# Altium schematic sheet NEB_ISE_INT.SchDoc
size A4; CompanyName: Altium; DrawnBy: Ch.W.; Organization: Altium Limited; Address1: L3, 12a Rodborough Rd; Address2: Frenchs Forest; Address3: NSW; Address4: Australia 2086; DocumentNumber: 5; Revision: V0.9; SheetNumber: 5; SheetTotal: 10
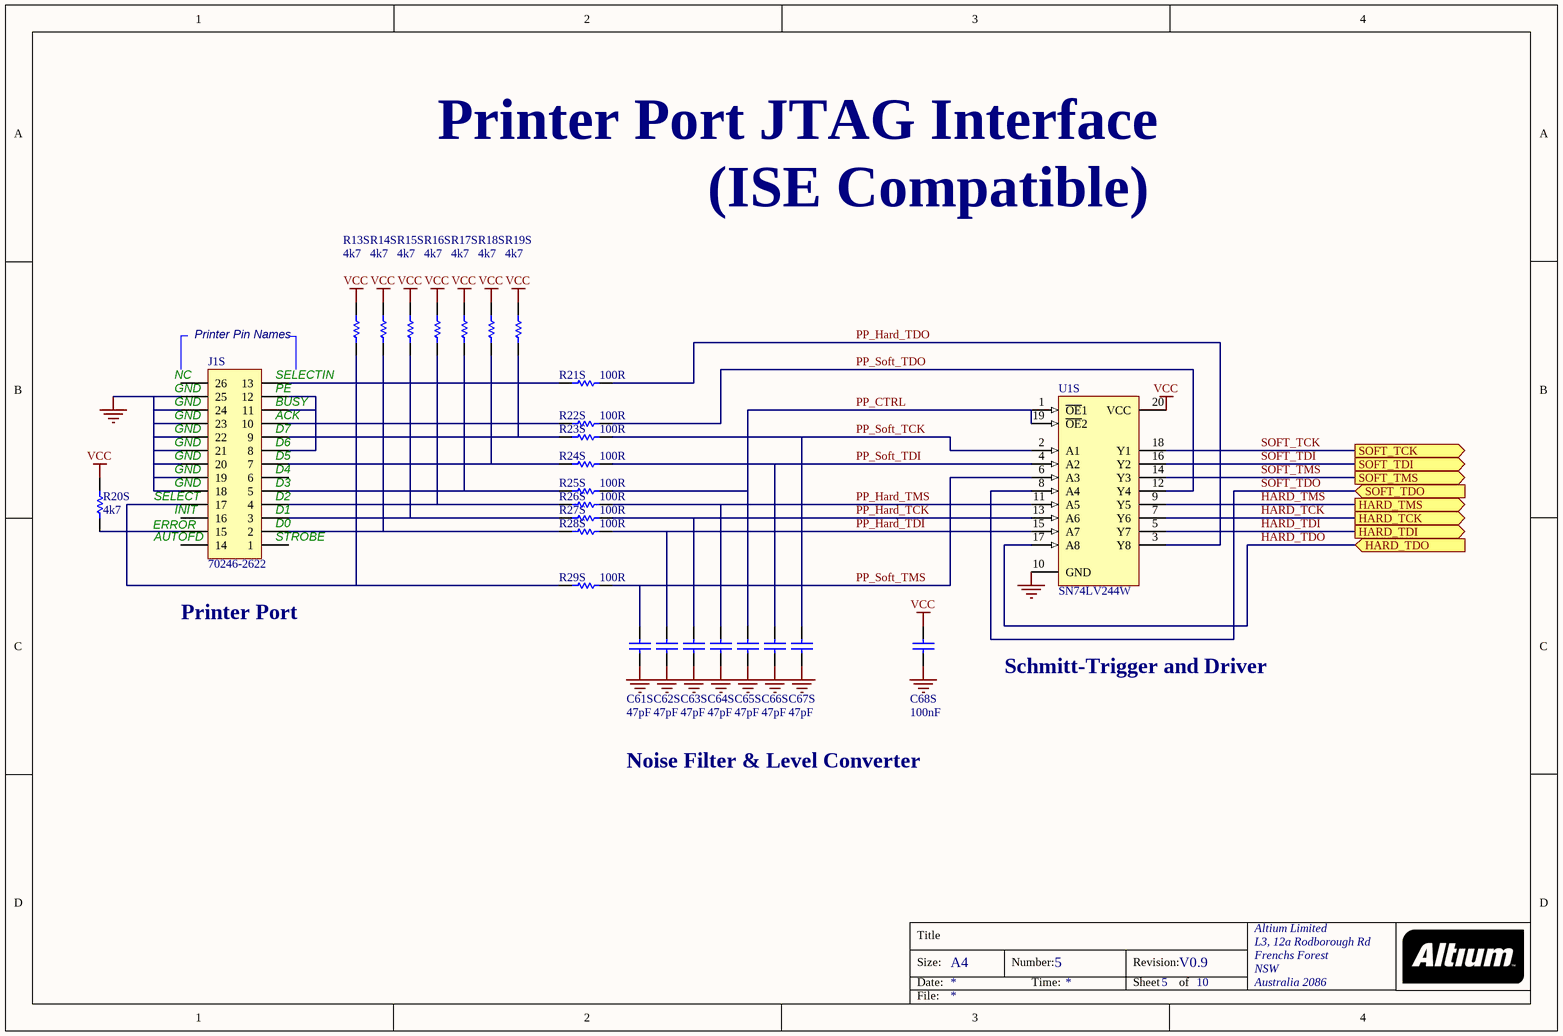
[diagram p0: NEB_ISE_INT.SchDoc]

## Parts
C61S  47pF  [CC2012-0805]
C62S  47pF  [CC2012-0805]
C63S  47pF  [CC2012-0805]
C64S  47pF  [CC2012-0805]
C65S  47pF  [CC2012-0805]
C66S  47pF  [CC2012-0805]
C67S  47pF  [CC2012-0805]
C68S  100nF  [CC2012-0805]
J1S  70246-2622  [HDR2X13_CEN_LP]
R13S  4k7  [CR2012-0805]
R14S  4k7  [CR2012-0805]
R15S  4k7  [CR2012-0805]
R16S  4k7  [CR2012-0805]
R17S  4k7  [CR2012-0805]
R18S  4k7  [CR2012-0805]
R19S  4k7  [CR2012-0805]
R20S  4k7  [CR2012-0805]
R21S  100R  [CR2012-0805]
R22S  100R  [CR2012-0805]
R23S  100R  [CR2012-0805]
R24S  100R  [CR2012-0805]
R25S  100R  [CR2012-0805]
R26S  100R  [CR2012-0805]
R27S  100R  [CR2012-0805]
R28S  100R  [CR2012-0805]
R29S  100R  [CR2012-0805]
U1S  SN74LV244W  [SSO-G20/P.65]

## Ports
HARD_TCK (out), HARD_TDI (out), HARD_TDO (in), HARD_TMS (out), SOFT_TCK (out), SOFT_TDI (out), SOFT_TDO (in), SOFT_TMS (out)

## Nets
GND: C61S.2 C62S.2 C63S.2 C64S.2 C65S.2 C66S.2 C67S.2 C68S.2 J1S.18 J1S.19 J1S.20 J1S.21 J1S.22 J1S.23 J1S.24 J1S.25 U1S.10(GND)
VCC: C68S.1 R13S.1 R14S.1 R15S.1 R16S.1 R17S.1 R18S.1 R19S.1 R20S.1 U1S.20(VCC)
HARD_TCK: U1S.7(Y6) ; port HARD_TCK
HARD_TDI: U1S.5(Y7) ; port HARD_TDI
HARD_TDO: U1S.17(A8) ; port HARD_TDO
HARD_TMS: U1S.9(Y5) ; port HARD_TMS
PP_CTRL: C65S.1 R25S.1 U1S.1(~{OE}1) U1S.19(~{OE}2)
PP_Hard_TCK: C63S.1 R27S.1 U1S.13(A6)
PP_Hard_TDI: C62S.1 R28S.1 U1S.15(A7)
PP_Hard_TDO: R21S.1 U1S.3(Y8)
PP_Hard_TMS: C64S.1 R26S.1 U1S.11(A5)
PP_Soft_TCK: C67S.1 R23S.1 U1S.2(A1)
PP_Soft_TDI: C66S.1 R24S.1 U1S.4(A2)
PP_Soft_TDO: R22S.1 U1S.12(Y4)
PP_Soft_TMS: C61S.1 R29S.1 U1S.6(A3)
SOFT_TCK: U1S.18(Y1) ; port SOFT_TCK
SOFT_TDI: U1S.16(Y2) ; port SOFT_TDI
SOFT_TDO: U1S.8(A4) ; port SOFT_TDO
SOFT_TMS: U1S.14(Y3) ; port SOFT_TMS
NetJ1S_2: J1S.2 R14S.2 R28S.2
NetJ1S_3: J1S.3 R15S.2 R27S.2
NetJ1S_4: J1S.4 R16S.2 R26S.2
NetJ1S_5: J1S.5 R17S.2 R25S.2
NetJ1S_7: J1S.7 R18S.2 R24S.2
NetJ1S_8: J1S.8 J1S.11 J1S.12
NetJ1S_9: J1S.9 R19S.2 R23S.2
NetJ1S_10: J1S.10 R22S.2
NetJ1S_13: J1S.13 R21S.2
NetJ1S_15: J1S.15 R20S.2
NetJ1S_17: J1S.17 R13S.2 R29S.2

Not connected (* = marked no-connect by the designer): J1S 1 6 14 16 26

## Notes on the sheet
- Printer Port JTAG Interface
- (ISE Compatible)
- (near J1S) NC
- Printer Pin Names
- (near J1S) SELECTIN
- (near J1S) GND
- (near J1S) PE
- (near J1S) BUSY
- (near J1S) ACK
- (near J1S) D6
- (near J1S) D7
- (near J1S) SELECT
- (near J1S) INIT
- (near J1S) D1
- (near J1S) D2
- (near J1S) D3
- (near J1S) D4
- (near J1S) D5
- (near J1S) ERROR
- (near J1S) AUTOFD
- (near J1S) STROBE
- (near J1S) D0
- Printer Port
- Schmitt-Trigger and Driver
- Noise Filter & Level Converter
- Title
- Size:
- Date:
- A4
- Number:
- Time:
- Revision:
- Sheet
- of
- File:

## Library data of the parts
C61S C62S C63S C64S C65S C66S C67S C68S = CAP: Capacitor; Fitted: True; Supplier: FARNELL; Supplier Code: 755-552
J1S = Header 13X2A: Header, 13-Pin, Dual row; Manufacturer: Generic Components; Class I: Connector; Fitted: True; Revision: July-2002: Re-released for DXP Platform.; Publisher: Altium Limited
R13S R14S R15S R16S R17S R18S R19S R20S R21S R22S R23S R24S R25S R26S R27S R28S R29S = RES: Resistor; Fitted: True
U1S = SN54LV244W: Octal Buffer/Driver with 3-State Outputs; Package Information: Latest Revision: Jan-1995; Published: 8-Jun-2000; Revision: 17-Jul-2002: Re-released for DXP Platform.; Datasheet: Latest Revision: Apr-1996; Package Reference: W020; Publisher: Altium Limited